# Altium schematic sheet SHEET1.SCHDOC
size A4
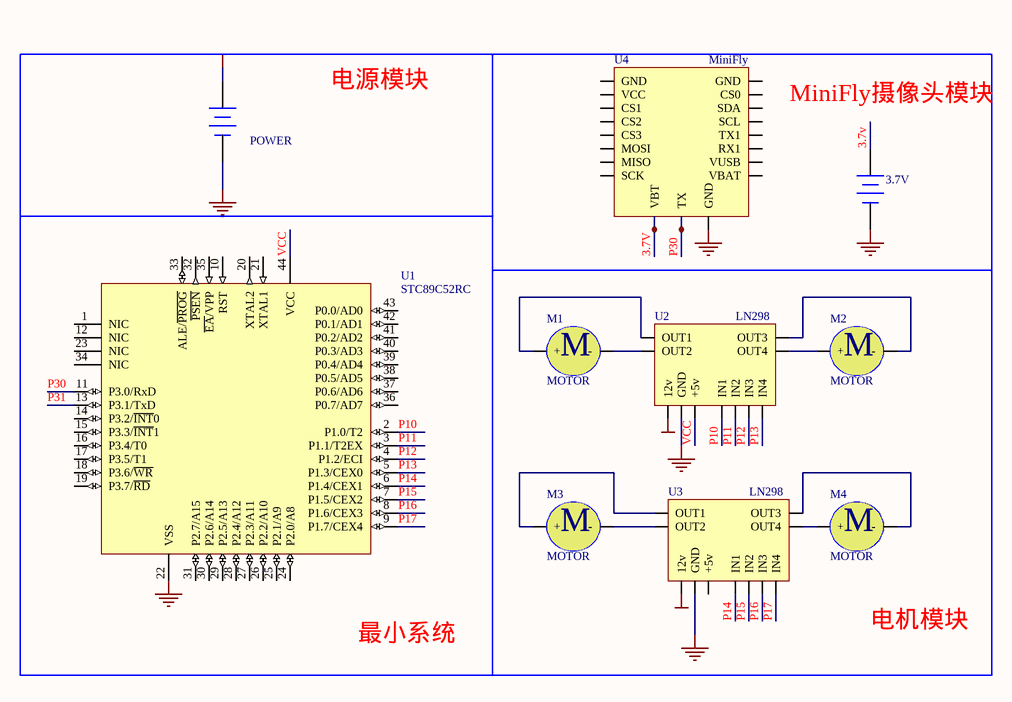
[diagram p0: SHEET1.SCHDOC]

## Parts
3.7V  (no value)  [BAT-2]
M1  MOTOR
M2  MOTOR
M3  MOTOR
M4  MOTOR
POWER  (no value)  [NKBATTERY]
U1  STC89C52RC  [SOT187-2]
U2  LN298
U3  LN298
U4  MiniFly

## Nets
7.4V: POWER.1(+) U2.4(12v) U3.4(12v)
GND: 3.7V.2(-) U1.22(VSS) U2.5(GND) U3.5(GND) U4.18(GND)
3.7V: 3.7V.1(+) U4.16(VBT)
P10: U1.2(P1.0/T2) U2.7(IN1)
P11: U1.3(P1.1/T2EX) U2.8(IN2)
P12: U1.4(P1.2/ECI) U2.9(IN3)
P13: U1.5(P1.3/CEX0) U2.10(IN4)
P14: U1.6(P1.4/CEX1) U3.7(IN1)
P15: U1.7(P1.5/CEX2) U3.8(IN2)
P16: U1.8(P1.6/CEX3) U3.9(IN3)
P17: U1.9(P1.7/CEX4) U3.10(IN4)
P30: U1.11(P3.0/RxD) U4.17(TX)
P31: U1.13(P3.1/TxD)
VCC: U1.44(VCC) U2.6(+5v)
NetM1_0: M1.0(+) U2.0(OUT1)
NetM1_1: M1.1(-) U2.1(OUT2)
NetM2_0: M2.0(+) U2.3(OUT4)
NetM2_1: M2.1(-) U2.2(OUT3)
NetM3_0: M3.0(+) U3.0(OUT1)
NetM3_1: M3.1(-) U3.1(OUT2)
NetM4_0: M4.0(+) U3.3(OUT4)
NetM4_1: M4.1(-) U3.2(OUT3)

Not connected (* = marked no-connect by the designer): POWER 2(+); U1 1(NIC) 10(RST) 12(NIC) 14(P3.2/~{INT}0) 15(P3.3/~{INT}1) 16(P3.4/T0) 17(P3.5/T1) 18(P3.6/~{WR}) 19(P3.7/~{RD}) 20(XTAL2) 21(XTAL1) 23(NIC) 24(P2.0/A8) 25(P2.1/A9) 26(P2.2/A10) 27(P2.3/A11) 28(P2.4/A12) 29(P2.5/A13) 30(P2.6/A14) 31(P2.7/A15) 32(~{PSEN}) 33(ALE/~{PROG}) 34(NIC) 35(~{EA}/VPP) 36(P0.7/AD7) 37(P0.6/AD6) 38(P0.5/AD5) 39(P0.4/AD4) 40(P0.3/AD3) 41(P0.2/AD2) 42(P0.1/AD1) 43(P0.0/AD0); U3 6(+5v); U4 0(GND) 1(VCC) 2(CS1) 3(CS2) 4(CS3) 5(MOSI) 6(MISO) 7(SCK) 8(GND) 9(CS0) 10(SDA) 11(SCL) 12(TX1) 13(RX1) 14(VBAT) 15(VUSB)

## Notes on the sheet
- 电源模块
- (near U4) MiniFly摄像头模块
- 电机模块
- 最小系统
- (in symbol MOTOR) M

## Library data of the parts
3.7V = Battery: Multicell Battery; Published: 24-Mar-1999; LatestRevisionDate: 17-Jul-2002; LatestRevisionNote: Re-released for DXP Platform.; Publisher: Altium Limited
POWER = BATTERY
U1 = P89C51RA2BA/01: 80C51 8-Bit Flash Microcontroller Family, 8 kB ISP/IAP Flash with 512 B RAM.; Published: 21-May-2003; DatasheetDocument: 18-Jul-2002; PackageDocument: 25-Jan-2000; PackageReference: SOT187-2; Publisher: Altium Limited; Code_JEDEC: MO-047AC